# Altium project LM2587_DC-DC.PrjPcb
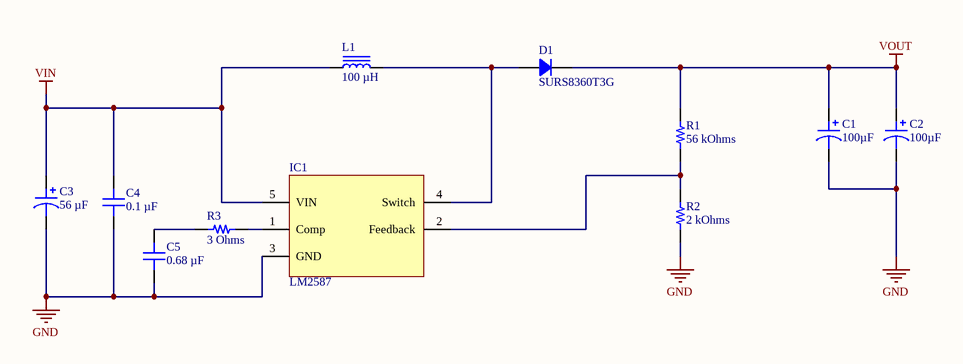
[diagram p0: LM2587SCH.SchDoc]
1 sheet, 11 parts. Net scope: global (net labels, ports and power ports of the same name join across sheets).
Board file: LM2587.PcbDoc

## Sheet LM2587SCH.SchDoc
size A2; SheetNumber: 1; SheetTotal: 1

### Parts
C1  100µF  [CAP ALSMD 8.3MM H10.5MM]
C2  100µF  [CAP ALSMD 8.3MM H10.5MM]
C3  56 µF  [CAP ALSMD 6.6MM H7.7MM]
C4  0.1 µF  [CAP 0805_2012]
C5  0.68 µF  [CAP 0805_2012]
D1  SURS8360T3G  [DO214AB SMC]
IC1  LM2587  [LM2596]
L1  100 µH  [7447070_inductor]
R1  56 kOhms  [RES 0805_2012]
R2  2 kOhms  [RES 0805_2012]
R3  3 Ohms  [RES 0805_2012]

### Nets
GND: C1.2 C2.2 C3.2 C4.1 C5.1 IC1.3(GND) R2.1
VIN: C3.1 C4.2 IC1.5(VIN) L1.1
VOUT: C1.1 C2.1 D1.2 R1.2
NetC5_2: C5.2 R3.1
NetD1_1: D1.1 IC1.4(Switch) L1.2
NetIC1_1: IC1.1(Comp) R3.2
NetIC1_2: IC1.2(Feedback) R1.1 R2.2

### Library data of the parts
C1 C2 = EEE-FK1H101P: CAP ALUM 100UF 20% 50V SMD; manufacturer: Panasonic Electronic Components; Impedance: 340 mOhms; Lifetime @ Temp.: 2000 Hrs @ 105°C; Polarization: Polar; Ripple Current @ High Frequency: 350mA @ 100kHz; Ripple Current @ Low Frequency: 262.5mA @ 120Hz; Surface Mount Land Size: 0.327" L x 0.327" W (8.30mm x 8.30mm); Part Number: EEE-FK1H101P; Applications: Automotive; Capacitance: 100µF; componentlink2description: DigiKey Link; componentlink2url: http://digikey.com/product-detail/en/panasonic-electronic-components/EEE-FK1H101P/PCE3809CT-ND/766185; Device Package: Radial, Can - SMD; Height - Seated (Max): 0.413" (10.50mm); lastupdated: 2.09.2020 01:25:16; Lifecycle Status: Active; Minimum Order: 1; Mounting Type: Surface Mount; Operating Temperature: -55°C ~ 105°C; Package / Case: Radial, Can - SMD; packaging: TapeAndReel; partid: 7485; Part Status: Active; price: 0.25; Ratings: AEC-Q200; series: FK; Size / Dimension: 0.315" Dia (8.00mm); Supplier 1: DigiKey; Supplier Part Number 1: PCE3809CT-ND; Tolerance: ±20%; value: 100µF; Voltage - Rated: 50V
C3 = UUD1V560MCL1GS: CAP ALUM 56UF 20% 35V SMD; manufacturer: Nichicon; Impedance: 340 mOhms; Lifetime @ Temp.: 2000 Hrs @ 105°C; Polarization: Polar; Ripple Current @ High Frequency: 280 mA @ 100 kHz; Ripple Current @ Low Frequency: 140 mA @ 120 Hz; Surface Mount Land Size: 0.260" L x 0.260" W (6.60mm x 6.60mm); Part Number: UUD1V560MCL1GS; Applications: Automotive; Capacitance: 56 µF; componentlink1description: Datasheet; componentlink1url: http://nichicon-us.com/english/products/pdfs/e-uud.pdf; componentlink2description: DigiKey Link; componentlink2url: https://www.digikey.com/en/products/detail/nichicon/UUD1V560MCL1GS/590029; Device Package: Radial, Can - SMD; Height - Seated (Max): 0.303" (7.70mm); lastupdated: 23.05.2022 13:47:38; Lifecycle Status: Active; Minimum Order: 1; Mounting Type: Surface Mount; Operating Temperature: -55°C ~ 105°C; Package / Case: Radial, Can - SMD; packaging: TapeAndReel; partid: 27263; Part Status: Active; price: 0.17; Ratings: AEC-Q200; series: UUD; Size / Dimension: 0.248" Dia (6.30mm); Supplier 1: DigiKey; Supplier Part Number 1: 493-2288-1-ND; Tolerance: ±20%; value: 56 µF; Voltage - Rated: 35 V
C4 = 0805B104J500CT: CAP CER 0.1UF 50V X7R 0805; manufacturer: Walsin Technology Corporation; Tolerance: ±5%; Part Number: 0805B104J500CT; Value: 0.1 µF; Applications: General Purpose; Capacitance: 0.1 µF; componentlink1description: Datasheet; componentlink1url: http://www.passivecomponent.com/wp-content/uploads/2018/10/MLCC.pdf; componentlink2description: DigiKey Link; componentlink2url: https://www.digikey.com/en/products/detail/walsin-technology-corporation/0805B104J500CT/9355061; Device Package: 0805 (2012 Metric); lastupdated: 23.05.2022 12:57:36; Lifecycle Status: Active; Minimum Order: 1; Mounting Type: Surface Mount, MLCC; Operating Temperature: -55°C ~ 125°C; Package / Case: 0805 (2012 Metric); packaging: TapeAndReel; partid: 15418; Part Status: Active; price: 0.02; series: -; Size / Dimension: 0.079" L x 0.049" W (2.00mm x 1.25mm); Supplier 1: DigiKey; Supplier Part Number 1: 1292-1564-1-ND; Temperature Coefficient: X7R; Thickness (Max): 0.035" (0.90mm); Voltage - Rated: 50V
C5 = C0805C684K5RACAUTO7210: CAP CER 0.68UF 50V X7R 0805; manufacturer: KEMET; Tolerance: ±10%; Part Number: C0805C684K5RACAUTO7210; Value: 0.68 µF; Applications: Automotive, Bypass, Decoupling; Capacitance: 0.68 µF; componentlink1description: Datasheet; componentlink1url: https://api.kemet.com/component-edge/download/datasheet/C0805C684K5RACAUTO7210.pdf; componentlink2description: DigiKey Link; componentlink2url: https://www.digikey.com/en/products/detail/kemet/C0805C684K5RACAUTO7210/11676953; Device Package: 0805 (2012 Metric); lastupdated: 23.05.2022 12:57:14; Lifecycle Status: Active; Minimum Order: 1; Mounting Type: Surface Mount, MLCC; Operating Temperature: -55°C ~ 125°C; Package / Case: 0805 (2012 Metric); packaging: TapeAndReel; partid: 32222; Part Status: Active; price: 0.05; Ratings: AEC-Q200; series: SMD Auto X7R; Size / Dimension: 0.079" L x 0.049" W (2.00mm x 1.25mm); Supplier 1: DigiKey; Supplier Part Number 1: 399-C0805C684K5RACAUTO7210CT-ND; Temperature Coefficient: X7R; Thickness (Max): 0.057" (1.45mm); Voltage - Rated: 50V
D1 = SURS8360T3G: DIODE GEN PURP 600V 3A SMC; Manufacturer: ON Semiconductor; Current - Reverse Leakage @ Vr: 10µA @ 600V; Diode Type: Standard; Reverse Recovery Time (trr): 75ns; Speed: Fast Recovery =< 500ns, > 200mA (Io); Voltage - Forward (Vf) (Max) @ If: 1.25V @ 3A; Part Number: SURS8360T3G; ComponentLink1Description: Datasheet; ComponentLink1URL: http://www.onsemi.com/pub/Collateral/MURS320T3-D.PDF; ComponentLink2Description: DigiKey Link; ComponentLink2URL: http://digikey.com/product-detail/en/on-semiconductor/SURS8360T3G/SURS8360T3GOSCT-ND/9087771; Current - Average Rectified (Io): 3A; LastUpdated: 23.05.2022 13:35:53; Lifecycle Status: Active; Minimum Order: 1; Mounting Type: Surface Mount; Operating Temperature - Junction: -65°C ~ 175°C; Package / Case: DO-214AB, SMC; Packaging: TapeAndReel; PartId: 348; Part Status: Active; Price: 0.30; Series: -; Supplier 1: DigiKey; Supplier Part Number 1: SURS8360T3GOSCT-ND; Supplier Device Package: SMC; Voltage - DC Reverse (Vr) (Max): 600V
IC1 = LM2587: Boost Converter
L1 = SRR1280-101M: FIXED IND 100UH 2.1A 150MOHM SMD; Manufacturer: Bourns Inc.; Current - Saturation: 2A; DC Resistance (DCR): 150mOhm Max; Frequency - Self Resonant: 4.5MHz; Inductance Frequency - Test: 100 kHz; Material - Core: Ferrite; Q @ Freq: 18 @ 796kHz; Shielding: Shielded; Tolerance: ±20%; Type: Wirewound; Part Number: SRR1280-101M; ComponentLink1Description: Datasheet; ComponentLink1URL: https://www.bourns.com/docs/Product-Datasheets/SRR1280.pdf; ComponentLink2Description: DigiKey Link; ComponentLink2URL: https://www.digikey.com/en/products/detail/bourns-inc/SRR1280-101M/2127044; Current Rating (Amps): 2.1 A; Device Package: Nonstandard; Height - Seated (Max): 0.315" (8.00mm); Inductance: 100 µH; LastUpdated: 23.05.2022 13:40:12; Lifecycle Status: Active; Minimum Order: 1; Mounting Type: Surface Mount; Operating Temperature: -40°C ~ 125°C; Package / Case: Nonstandard; Packaging: TapeAndReel; PartId: 24; Part Status: Active; Price: 0.57; Series: SRR1280; Size / Dimension: 0.492" L x 0.492" W (12.50mm x 12.50mm); Supplier 1: DigiKey; Supplier Part Number 1: SRR1280-101MCT-ND; Value: 100 µH
R1 = RMCF0805FT56K0: RES 56K OHM 1% 1/8W 0805; Manufacturer: Stackpole Electronics Inc; Power (Watts): 0.125W, 1/8W; Temperature Coefficient: ±100ppm/°C; Part Number: RMCF0805FT56K0; Value: 56 kOhms; ComponentLink1Description: Datasheet; ComponentLink1URL: https://www.seielect.com/catalog/sei-packaging.pdf; ComponentLink2Description: DigiKey Link; ComponentLink2URL: https://www.digikey.com/en/products/detail/stackpole-electronics-inc/RMCF0805FT56K0/1760366; Composition: Thick Film; Device Package: 0805 (2012 Metric); Features: Automotive AEC-Q200; Height - Seated (Max): 0.026" (0.65mm); LastUpdated: 23.05.2022 13:27:55; Lifecycle Status: Active; Minimum Order: 1; Number of Terminations: 2; Operating Temperature: -55°C ~ 155°C; Package / Case: 0805 (2012 Metric); Packaging: CutTape; PartId: 32591; Part Status: Active; Price: 0.01; Ratings: AEC-Q200; Resistance: 56 kOhms; Series: RMCF; Size / Dimension: 0.079" L x 0.049" W (2.00mm x 1.25mm); Supplier 1: DigiKey; Supplier Part Number 1: RMCF0805FT56K0CT-ND; Supplier Device Package: 0805; Tolerance: ±1%
R2 = RCS08052K00FKEA: RES SMD 2K OHM 1% 0.4W 0805; Manufacturer: Vishay Dale; Power (Watts): 0.4W, 2/5W; Temperature Coefficient: ±100ppm/°C; Part Number: RCS08052K00FKEA; Value: 2 kOhms; ComponentLink1Description: Datasheet; ComponentLink1URL: http://www.vishay.com/docs/20065/rcse3.pdf; ComponentLink2Description: DigiKey Link; ComponentLink2URL: https://www.digikey.com/en/products/detail/vishay-dale/RCS08052K00FKEA/5866986; Composition: Thick Film; Device Package: 0805 (2012 Metric); Features: Automotive AEC-Q200, Pulse Withstanding; Height - Seated (Max): 0.020" (0.50mm); LastUpdated: 23.05.2022 13:28:13; Lifecycle Status: Active; Minimum Order: 1; Number of Terminations: 2; Operating Temperature: -55°C ~ 155°C; Package / Case: 0805 (2012 Metric); Packaging: TapeAndReel; PartId: 27786; Part Status: Active; Price: 0.03; Ratings: AEC-Q200; Resistance: 2 kOhms; Series: RCS e3; Size / Dimension: 0.079" L x 0.049" W (2.00mm x 1.25mm); Supplier 1: DigiKey; Supplier Part Number 1: 541-2840-1-ND; Supplier Device Package: 0805; Tolerance: ±1%
R3 = ERJ-6BQF3R0V: RES SMD 3 OHM 1% 1/3W 0805; Manufacturer: Panasonic Electronic Components; Power (Watts): 0.333W, 1/3W; Temperature Coefficient: ±200ppm/°C; Part Number: ERJ-6BQF3R0V; Value: 3 Ohms; ComponentLink1Description: Datasheet; ComponentLink1URL: https://industrial.panasonic.com/cdbs/www-data/pdf/RDN0000/AOA0000C313.pdf; ComponentLink2Description: DigiKey Link; ComponentLink2URL: https://www.digikey.com/en/products/detail/panasonic-electronic-components/ERJ-6BQF3R0V/5647539; Composition: Thick Film; Device Package: 0805 (2012 Metric); Features: Automotive AEC-Q200, Current Sense; Height - Seated (Max): 0.028" (0.70mm); LastUpdated: 23.05.2022 13:27:31; Lifecycle Status: Active; Minimum Order: 1; Number of Terminations: 2; Operating Temperature: -55°C ~ 155°C; Package / Case: 0805 (2012 Metric); Packaging: TapeAndReel; PartId: 38851; Part Status: Active; Price: 0.06; Ratings: AEC-Q200; Resistance: 3 Ohms; Series: ERJ-6B; Size / Dimension: 0.079" L x 0.049" W (2.00mm x 1.25mm); Supplier 1: DigiKey; Supplier Part Number 1: P17506CT-ND; Supplier Device Package: 0805; Tolerance: ±1%